# EAGLE design piezo-preamp-alex-rice-FETS v2 (EAGLE 6.2)
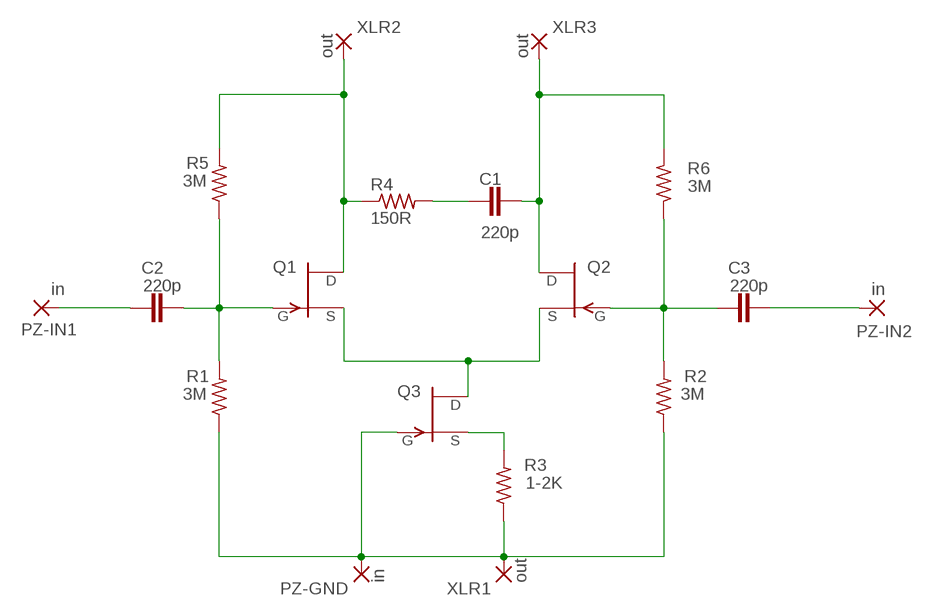
[diagram p0: schematic, sheet 1]

## Parts
C1  220p  C-EU050-030X075  [C050-030X075]
C2  220p  C-EU050-030X075  [C050-030X075]
C3  220p  C-EU050-030X075  [C050-030X075]
PZ-GND  in  3,81/1,1  [3,81/1,1]
PZ-IN1  in  3,81/1,1  [3,81/1,1]
PZ-IN2  in  3,81/1,1  [3,81/1,1]
Q1  2N3819  2N3819-WIDETO92_WIDE  [TO92]
Q2  2N3819-WIDETO92_WIDE  [TO92]
Q3  2N3819-WIDETO92_WIDE  [TO92]
R1  3M  R-US_0414/5V  [0414V]
R2  3M  R-US_0414/5V  [0414V]
R3  1-2K  R-US_0414/5V  [0414V]
R4  150R  R-US_0414/5V  [0414V]
R5  3M  R-US_0414/5V  [0414V]
R6  3M  R-US_0414/5V  [0414V]
XLR1  out  3,81/1,1  [3,81/1,1]
XLR2  out  3,81/1,1  [3,81/1,1]
XLR3  out  3,81/1,1  [3,81/1,1]

## Nets
GND: PZ-GND.1(P) Q3.2(G) R1.1 R2.1 R3.1 XLR1.1(P)
N$1: Q1.1(D) R4.1 R5.2 XLR2.1(P)
N$2: C1.2 Q2.1(D) R6.2 XLR3.1(P)
N$3: C1.1 R4.2
N$4: C3.1 Q2.2(G) R2.2 R6.1
N$5: C2.2 Q1.2(G) R1.2 R5.1
N$8: Q3.3(S) R3.2
N$10: C2.1 PZ-IN1.1(P)
N$11: Q1.3(S) Q2.3(S) Q3.1(D)
N$12: C3.2 PZ-IN2.1(P)

## Library data of the parts
C1-C3 = rcl:C-EU: CAPACITOR, European symbol
PZ-GND PZ-IN1 PZ-IN2 XLR1-XLR3 = wirepad:3,81/1,1: THROUGH-HOLE PAD
Q1-Q3 = T092_wide:2N3819-WIDE: N-Channel Junction FET
R1-R3 R5 R6 = rcl:R-US_: RESISTOR, American symbol
R4 = resistor:R-US_: RESISTOR, American symbol

## Board
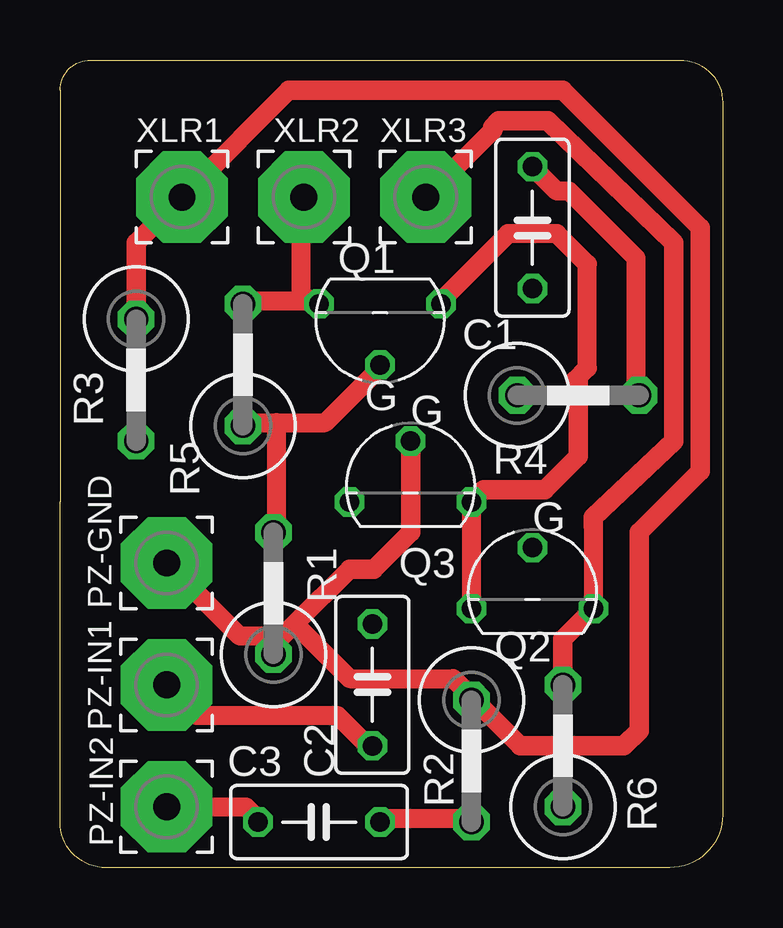
[diagram p1: board, top side]
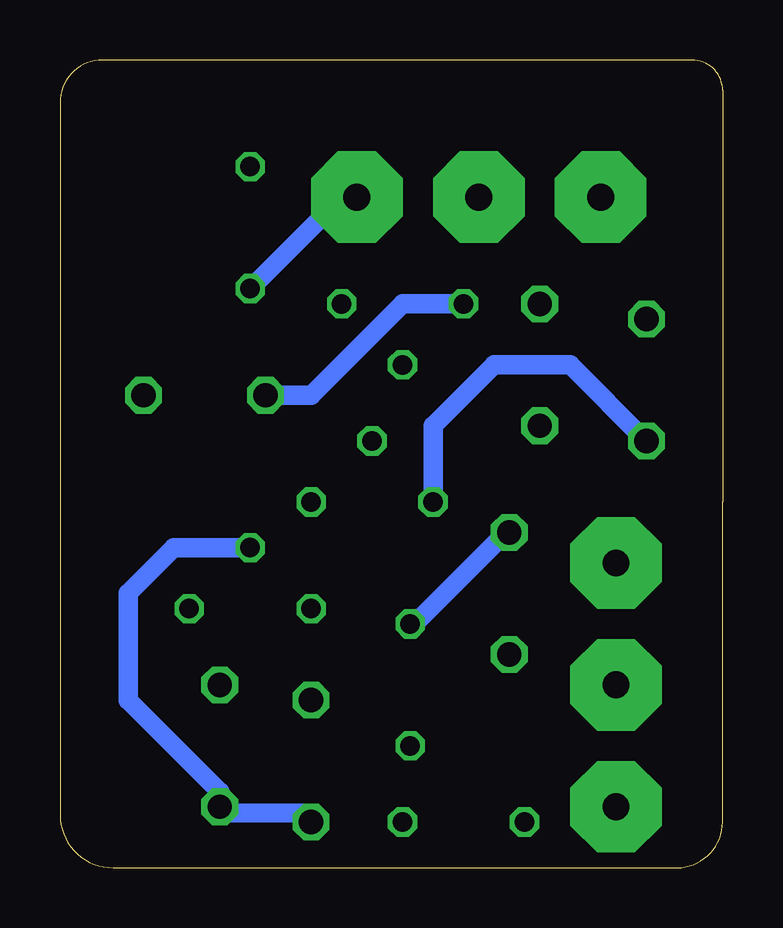
[diagram p2: board, bottom side, seen from below]

Size 27.61 x 33.66 mm. Coordinates in mm from the lower left corner, seen from the top.
Outline: 0,32.38 0,15.24 0,1.91 arc90 1.91,0 25.4,0 arc90 27.61,2.21 27.61,31.88 arc90 25.83,33.66 1.27,33.66 arc90 0,32.38
Copper layers (1*16): Top 0.0356mm / dielectric 1.5011mm / Bottom 0.0356mm
Design rules "default": minimum track width 6mil, minimum drill 13mil, track to track 6mil, track to pad 6mil, pad to pad 6mil, via to via 6mil, smd to smd 6mil, copper to edge 15mil, drill to drill 6mil, minimum pad ring 7mil, minimum via ring 7mil, stop-mask expansion 4mil, vias tented up to drill 0mil, thermal gap 10mil

### Footprints (pad centres in the part's own frame; a part is rotated, then mirrored left to right if it is on the bottom)
C050-030X075 = drill 0.813 octagon: 1 -2.54,0; 2 2.54,0
3,81/1,1 = drill 1.118 pad 3.81 octagon: 1 0,0
TO92 = drill 0.813 octagon: 1 2.54,-0.635; 2 0,1.905; 3 -2.54,-0.635
0414V = drill 1.016 octagon: 1 -2.54,0; 2 2.54,0

### Placement (x,y rotation side)
C1  19.68,26.67 270 top
C2  13.02,7.62 90 top
C3  10.79,1.91 180 top
PZ-GND  4.45,12.7 90 top
PZ-IN1  4.45,7.62 90 top
PZ-IN2  4.45,2.54 0 top
Q1  13.34,22.86 180 top
Q2  19.68,11.43 0 top
Q3  14.61,15.88 0 top
R1  8.89,11.43 90 top
R2  17.14,4.45 270 top
R3  3.17,20.32 270 top
R4  21.59,19.68 0 top
R5  7.62,20.95 90 top
R6  20.95,5.08 90 top
XLR1  5.08,27.94 0 top
XLR2  10.16,27.94 0 top
XLR3  15.24,27.94 0 top

### Tracks (layer width: path | path; a pad name or v marks a point on that pad's centre or on a via)
GND
  Top 0.8: 9.78,10.16 9.02,9.4 9.02,8.89 R1.1 8.76,9.65 7.49,9.65 PZ-GND.1 | 9.78,10.16 12.06,12.45 | 9.78,10.16 12.06,7.87 16.38,7.87 17.14,7.11 R2.1 17.4,6.86 19.18,5.08 | 5.46,27.94 XLR1.1
  Top 0.813: 12.06,12.45 13.08,12.45 14.61,13.97 Q3.2 | R3.1 3.17,26.04 XLR1.1 | 5.46,27.94 5.46,28.32 9.53,32.38 20.95,32.38 26.67,26.67 26.67,16.51 24.13,13.97 24.13,5.71 23.49,5.08 19.18,5.08
N$1
  Top 0.8: R5.2 7.75,23.62 10.79,23.62 Q1.1 10.03,23.88 10.03,27.94 XLR2.1
  Bottom 0.813: Q1.1 13.34,23.5 17.14,19.68 R4.1
N$2
  Top 0.8: 22.22,14.22 Q2.1 | 15.11,27.94 XLR3.1
  Top 0.813: R6.2 20.95,9.53 Q2.1 | 22.22,14.22 22.22,14.61 25.58,17.78 25.58,26.04 20.32,31.11 18.29,31.11 18.03,30.86 18.03,30.73 XLR3.1
  Bottom 0.8: C1.2 15.88,27.94 XLR3.1
N$3
  Top 0.8: C1.1 20.7,28.19 21.21,28.19 24,25.4 24,19.81 R4.2
N$4
  Top 0.8: C3.1 13.34,2.03 17.14,2.03 R2.2
  Bottom 0.8: R2.2 17.14,2.03 17.4,2.29 20.7,2.29 R6.1
  Bottom 0.813: R6.1 20.95,3.17 24.76,6.99 24.76,11.43 22.86,13.34 Q2.2
N$5
  Top 0.8: 9.02,18.54 7.75,18.54 R5.1 | 9.02,18.54 11.05,18.54 13.34,20.83 Q1.2 | 9.02,18.54 9.02,13.97 R1.2
  Bottom 0.8: C2.2 12.83,10.16 9.02,13.97 R1.2
N$8
  Bottom 0.813: R3.2 6.35,20.95 9.53,20.95 12.06,18.41 Q3.3
N$10
  Top 0.8: PZ-IN1.1 5.71,6.35 11.56,6.35 12.83,5.08 C2.1
N$11
  Top 0.8: Q2.3 Q3.1 17.65,15.75 | 21.46,20.32 21.97,20.83 21.97,25.15 20.7,26.42 18.67,26.42 15.88,23.62 Q1.3
  Top 0.813: 17.65,15.75 20.19,15.75 21.59,17.14 21.59,20.19 21.46,20.32
N$12
  Top 0.8: PZ-IN2.1 7.75,2.54 8.26,2.03 C3.2

### Text on the board
tNames: G | G | G